# Altium project ATLAS_XP2V5.2016.11.14.PrjPcb (part 2 of 2)

## Sheet ISA_XILINX.SchDoc: ATLAS_XP2V5
size 558 x 431 mm; Organization: IMP Automatika d.o.o.; Revision: V5
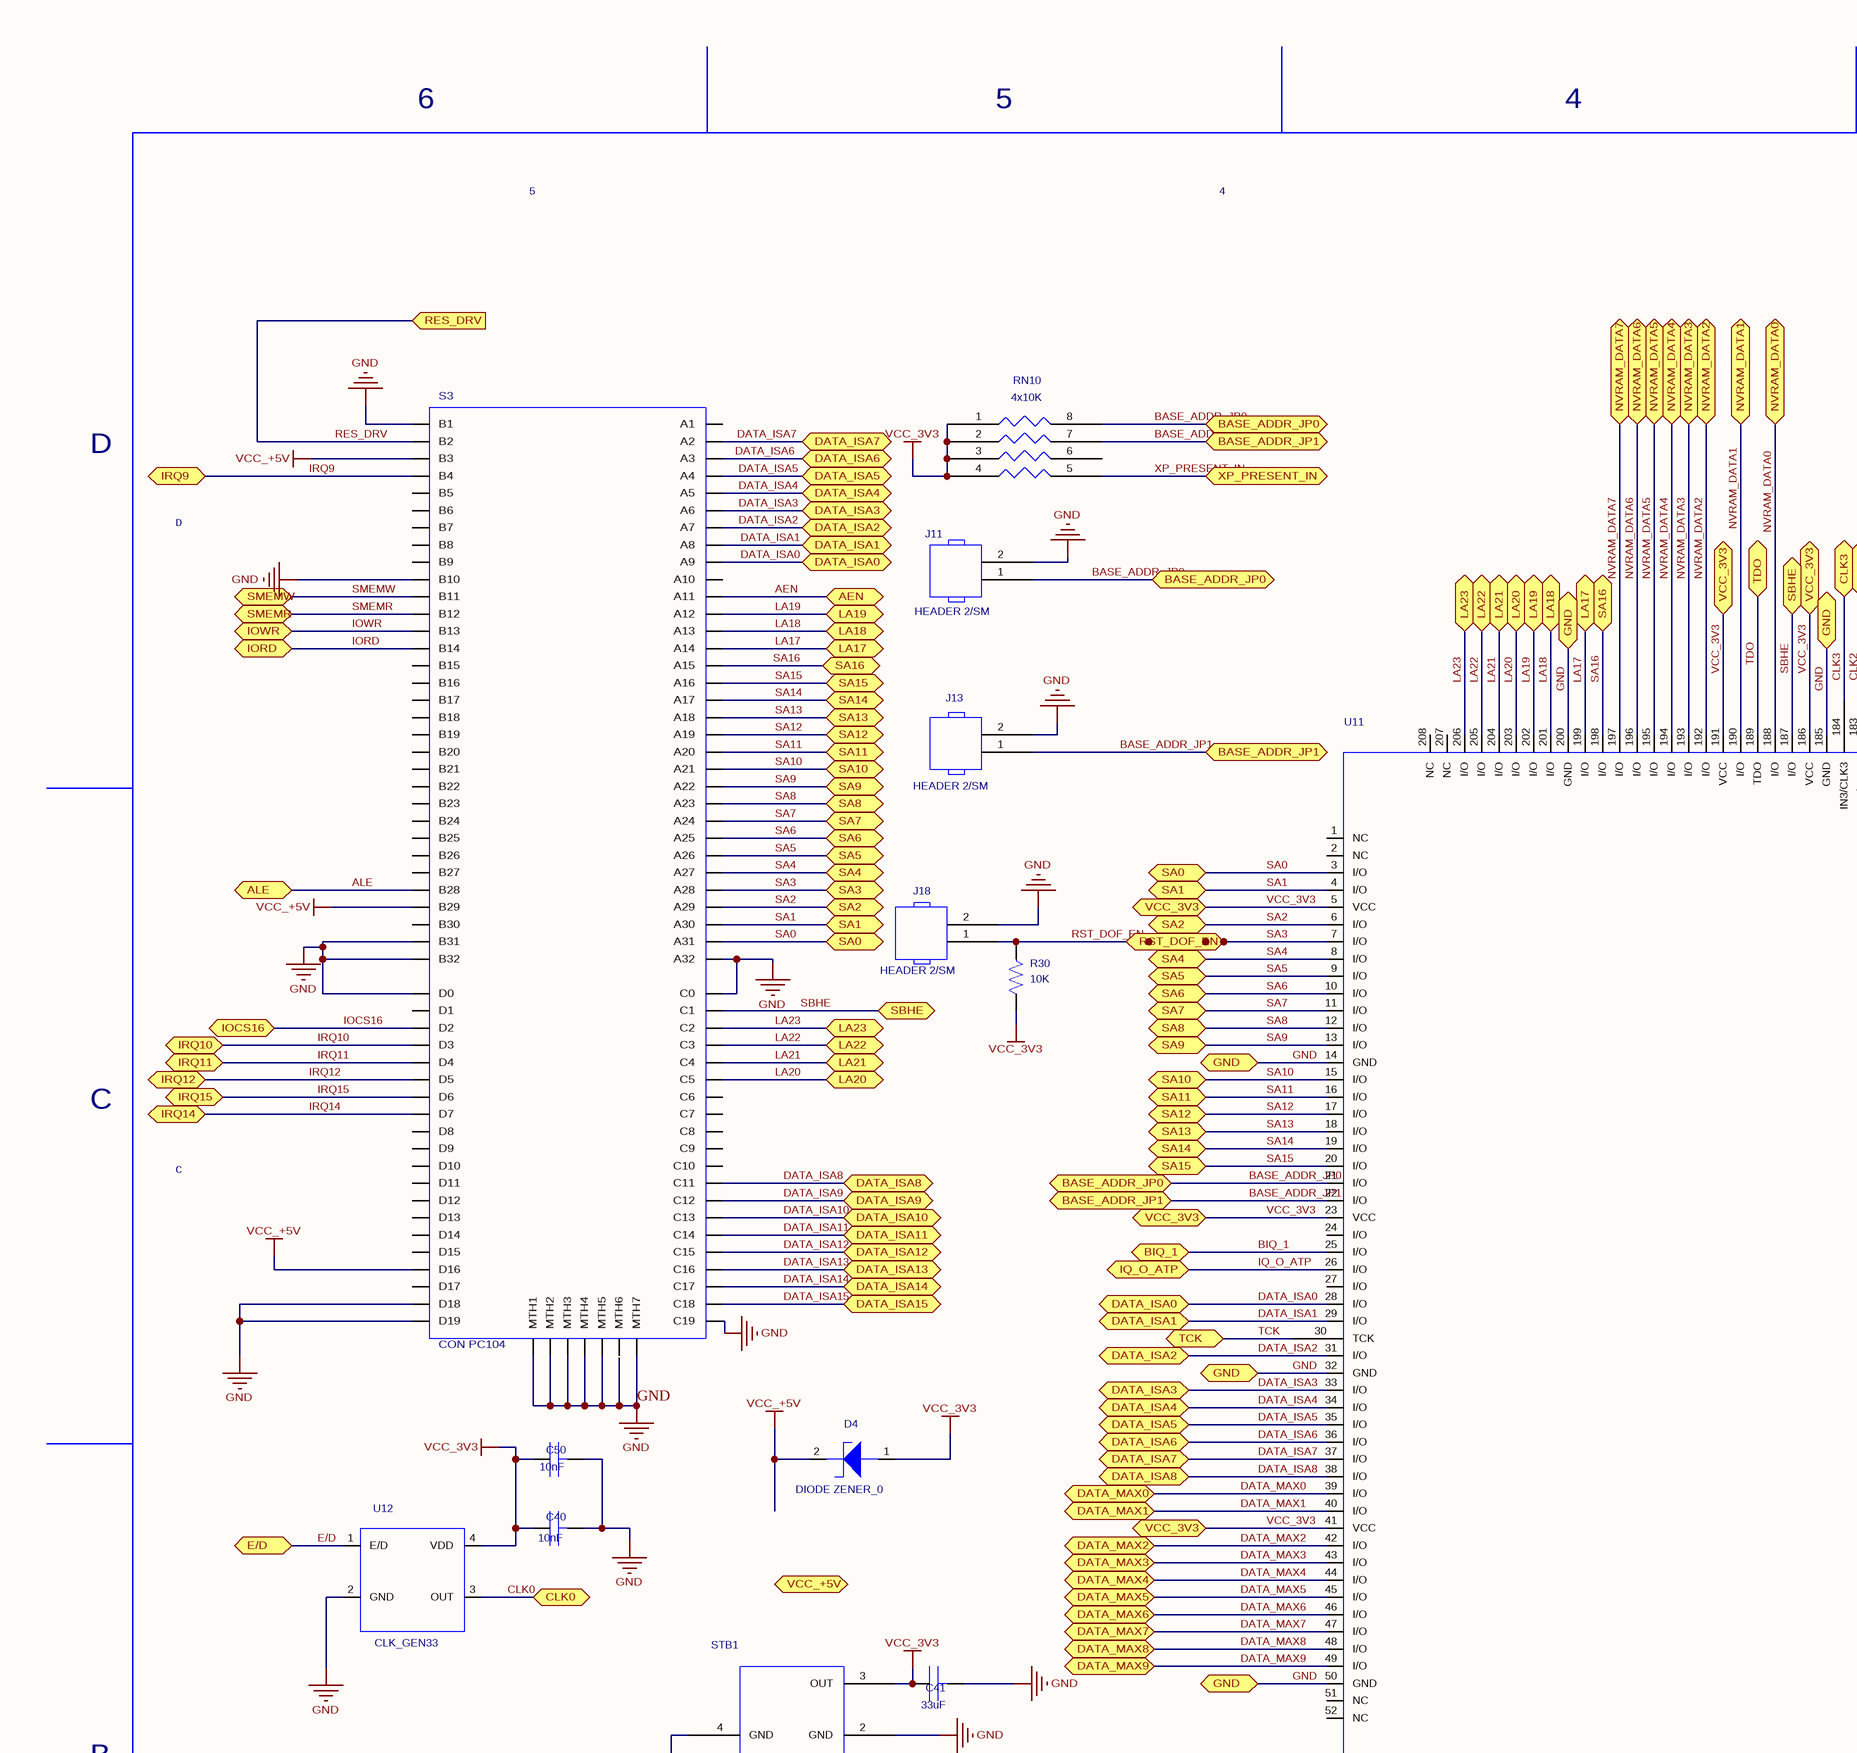
[diagram p20: ISA_XILINX.SchDoc, top left]
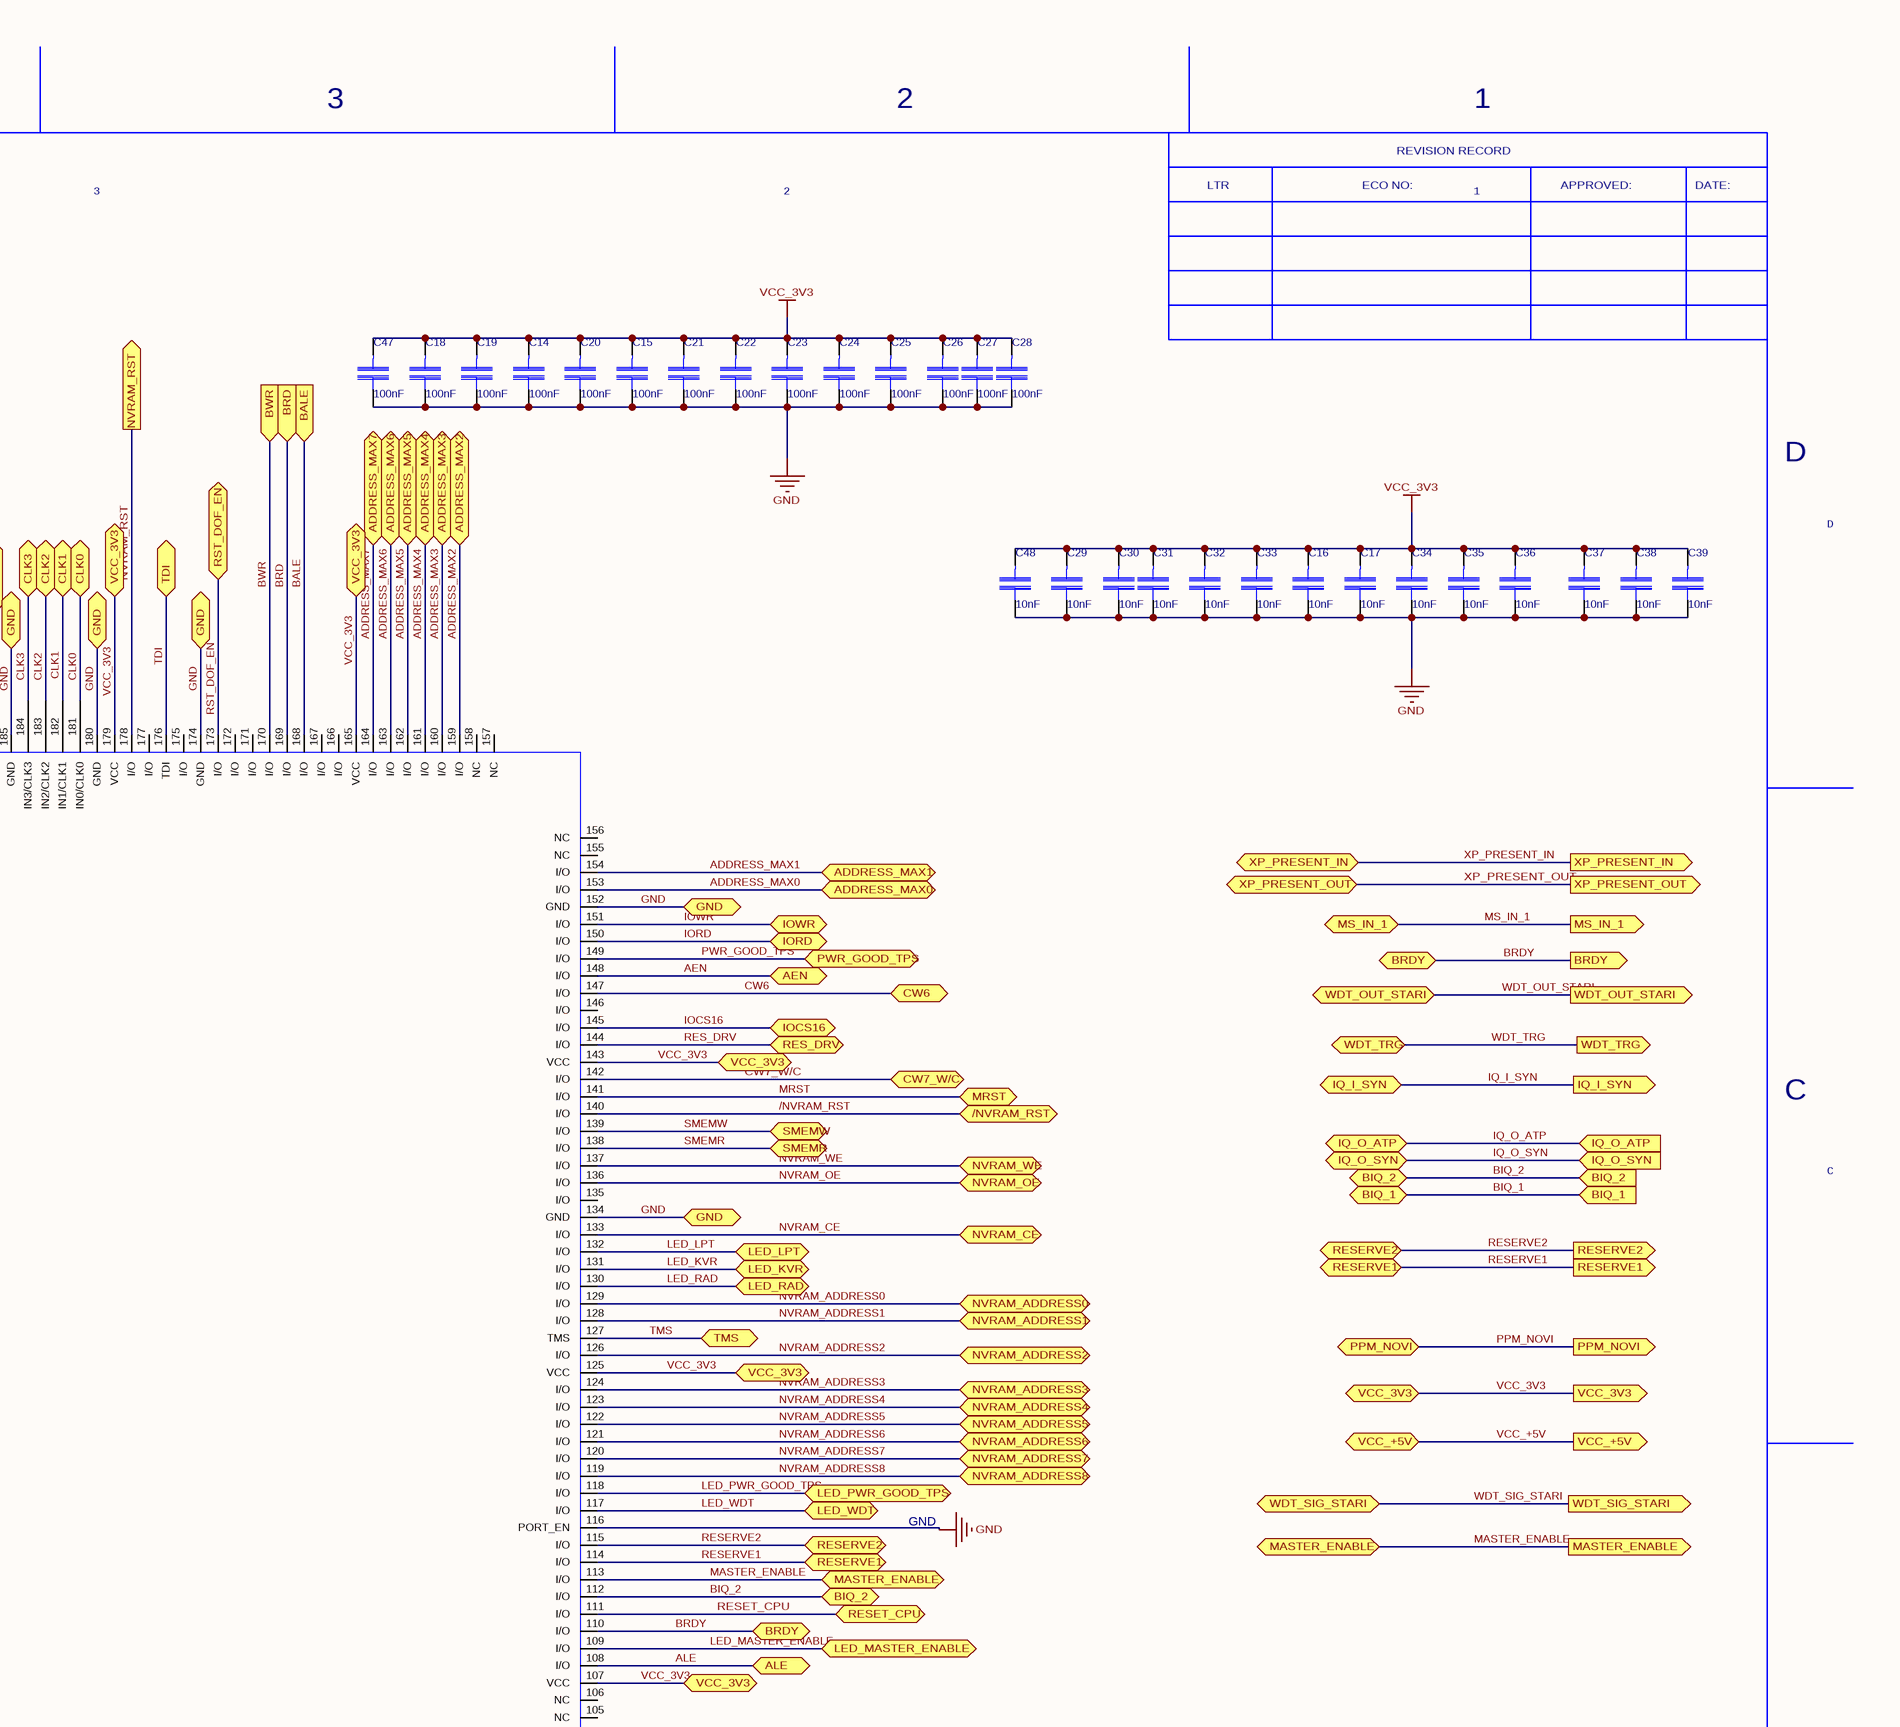
[diagram p21: ISA_XILINX.SchDoc, top right]
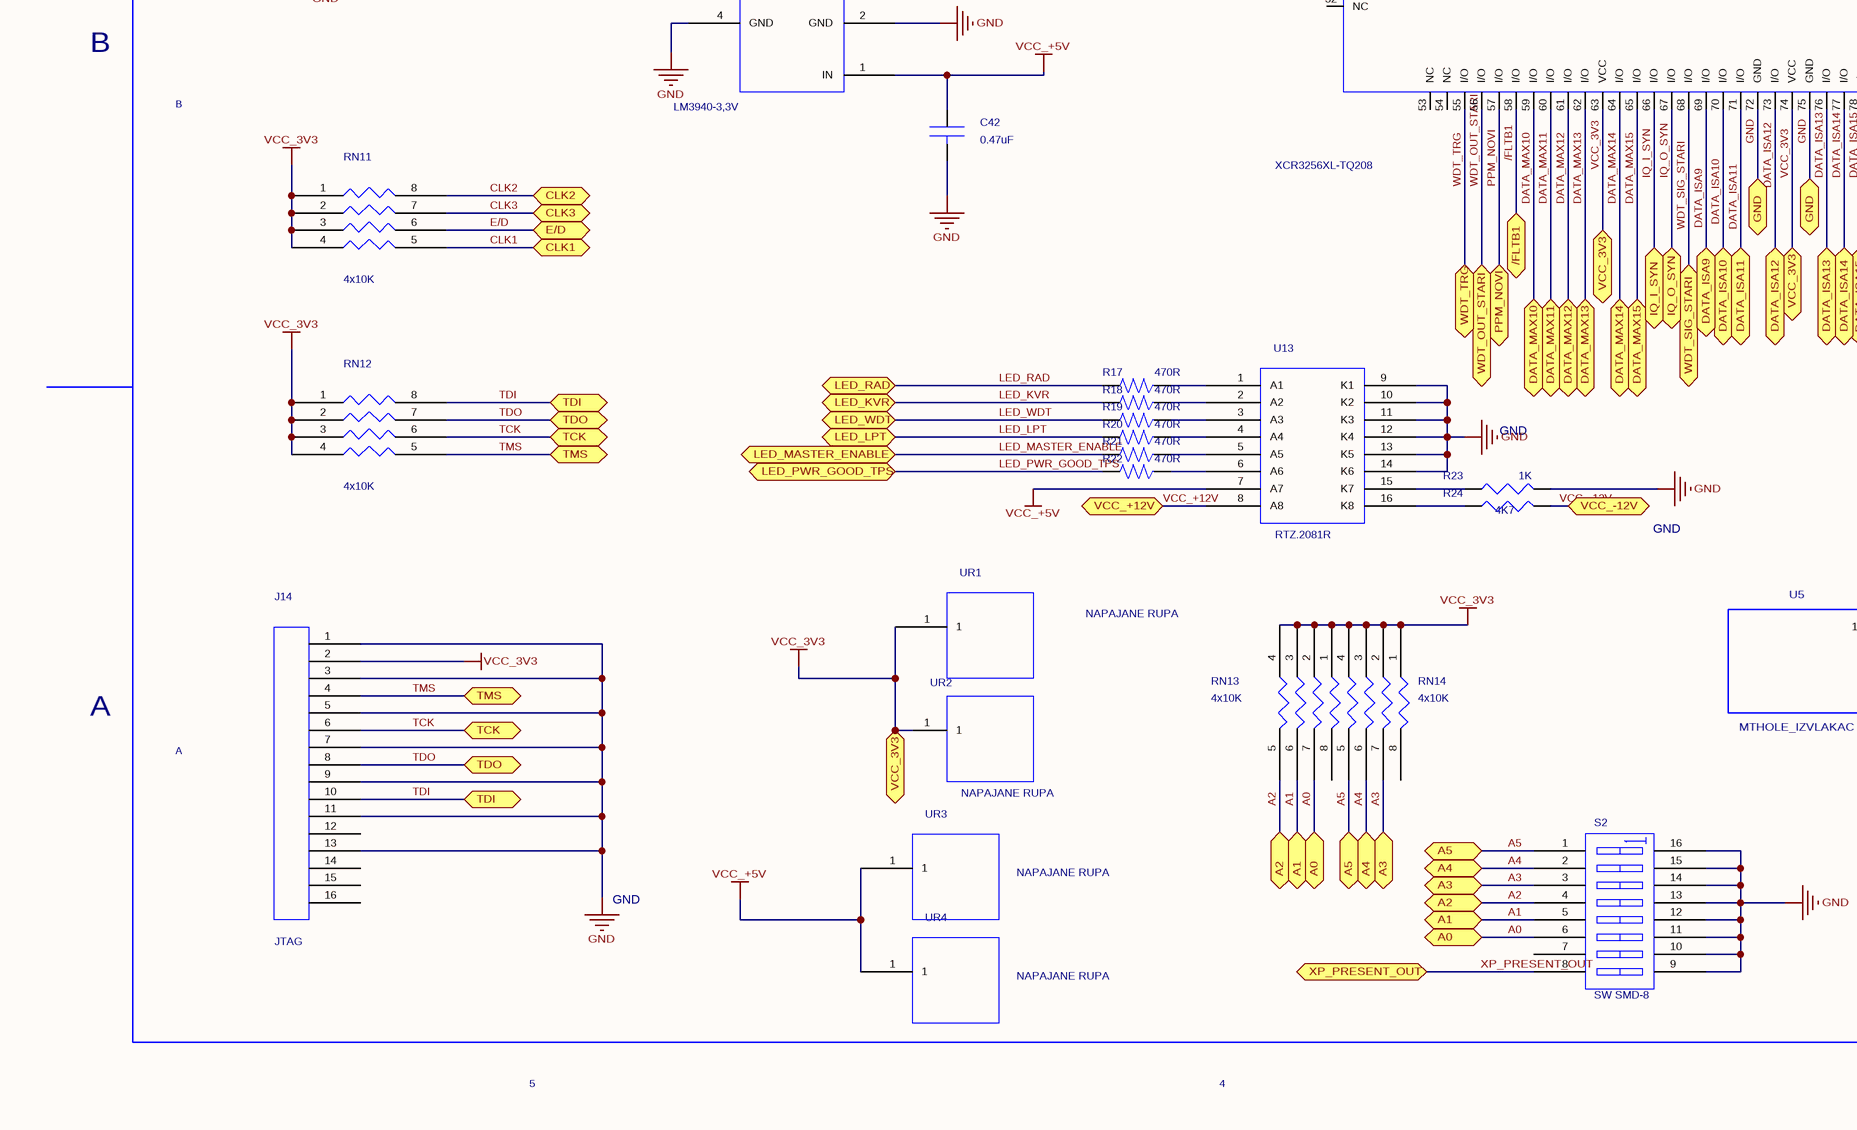
[diagram p22: ISA_XILINX.SchDoc, bottom left]
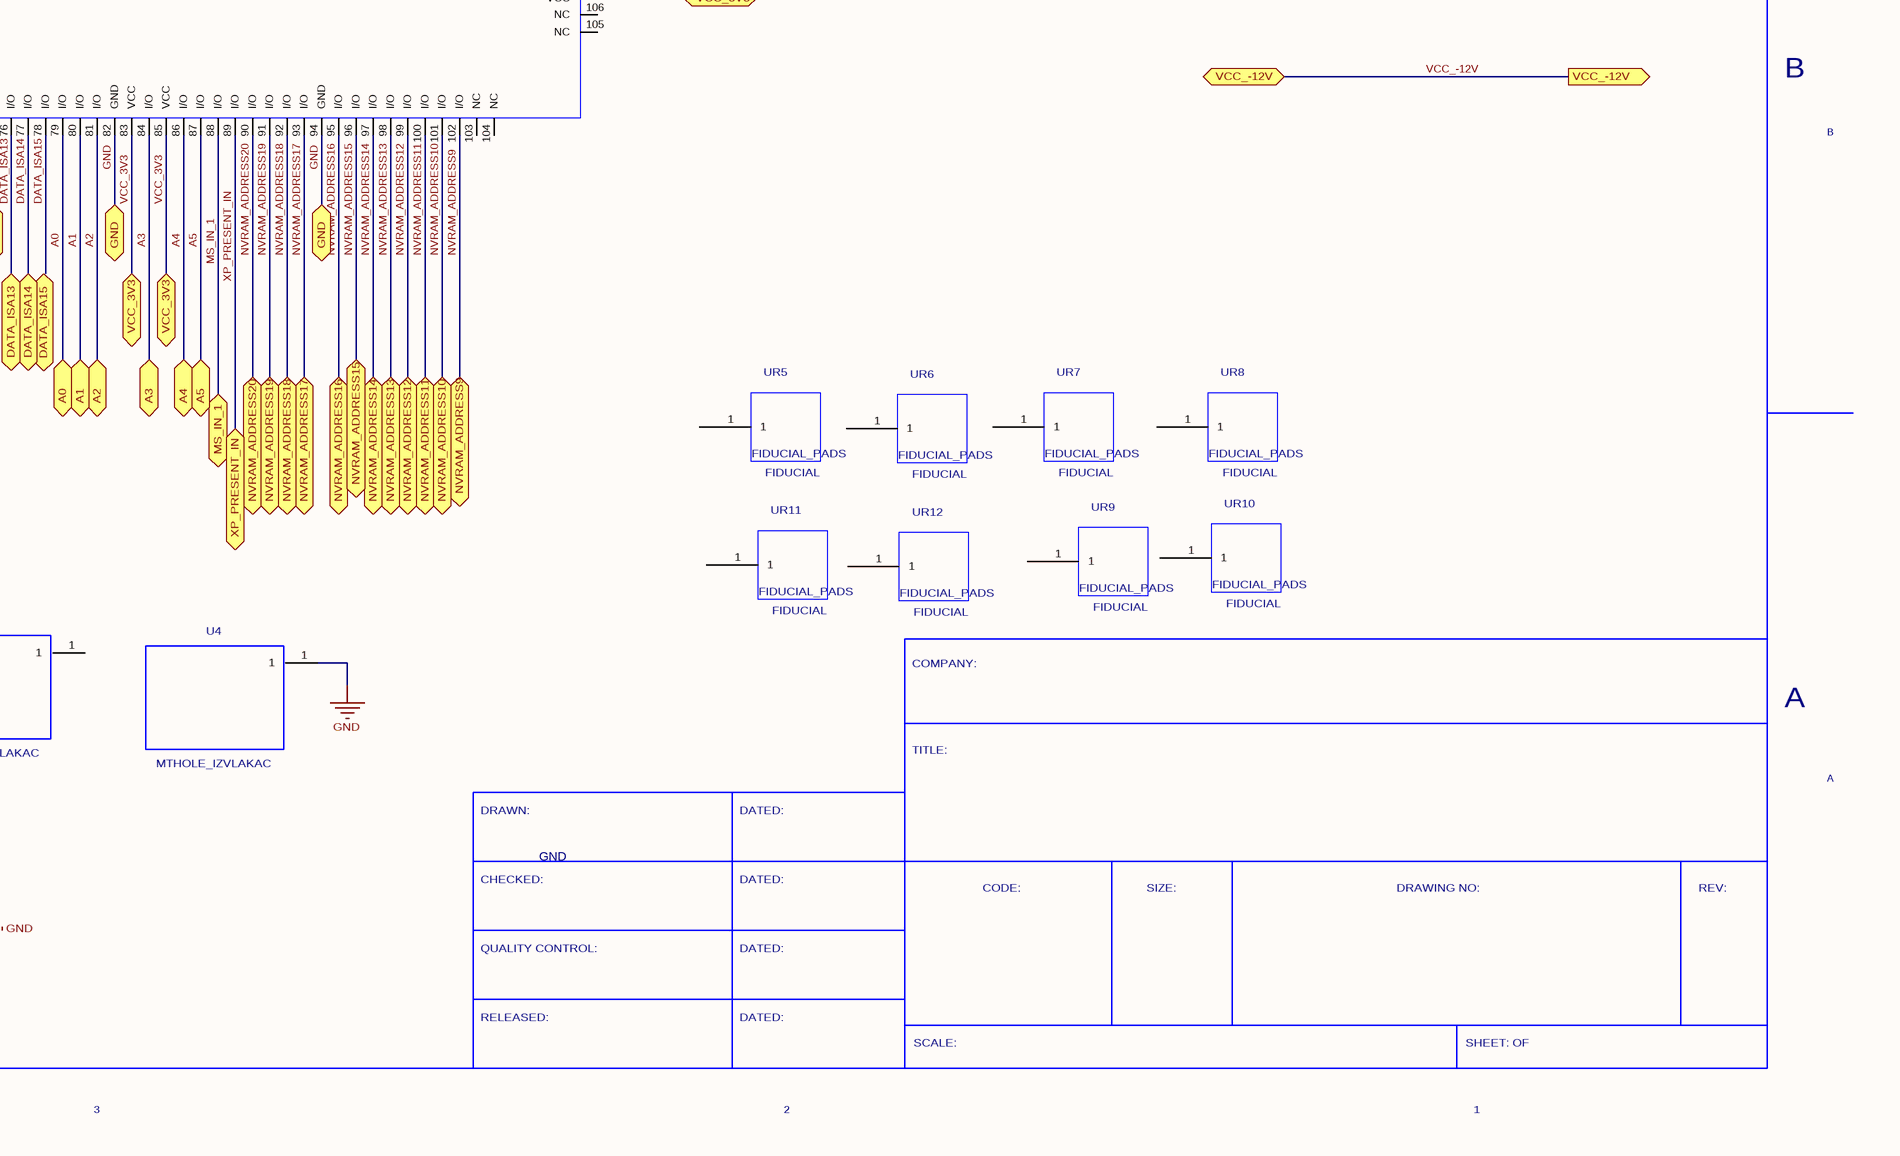
[diagram p23: ISA_XILINX.SchDoc, bottom right]

### Parts
C14  value 100nF  [SM/C_0805]  (hidden comment: C)
C15  value 100nF  [SM/C_0805]  (hidden comment: C)
C16  value 10nF  [SM/C_0805]  (hidden comment: C)
C17  value 10nF  [SM/C_0805]  (hidden comment: C)
C18  value 100nF  [SM/C_0805]  (hidden comment: C)
C19  value 100nF  [SM/C_0805]  (hidden comment: C)
C20  value 100nF  [SM/C_0805]  (hidden comment: C)
C21  value 100nF  [SM/C_0805]  (hidden comment: C)
C22  value 100nF  [SM/C_0805]  (hidden comment: C)
C23  value 100nF  [SM/C_0805]  (hidden comment: C)
C24  value 100nF  [SM/C_0805]  (hidden comment: C)
C25  value 100nF  [SM/C_0805]  (hidden comment: C)
C26  value 100nF  [SM/C_0805]  (hidden comment: C)
C27  value 100nF  [SM/C_0805]  (hidden comment: C)
C28  value 100nF  [SM/C_0805]  (hidden comment: C)
C29  value 10nF  [SM/C_0805]  (hidden comment: C)
C30  value 10nF  [SM/C_0805]  (hidden comment: C)
C31  value 10nF  [SM/C_0805]  (hidden comment: C)
C32  value 10nF  [SM/C_0805]  (hidden comment: C)
C33  value 10nF  [SM/C_0805]  (hidden comment: C)
C34  value 10nF  [SM/C_0805]  (hidden comment: C)
C35  value 10nF  [SM/C_0805]  (hidden comment: C)
C36  value 10nF  [SM/C_0805]  (hidden comment: C)
C37  value 10nF  [SM/C_0805]  (hidden comment: C)
C38  value 10nF  [SM/C_0805]  (hidden comment: C)
C39  value 10nF  [SM/C_0805]  (hidden comment: C)
C40  value 10nF  [SM/C_0805]  (hidden comment: C_4)
C41  value 33uF  [CASE_D_MILOS]  (hidden comment: C_4)
C42  value 0.47uF  [CASE_B_MILOS]  (hidden comment: C_4)
C47  value 100nF  [SM/C_0805]  (hidden comment: C)
C48  value 10nF  [SM/C_0805]  (hidden comment: C)
C50  value 10nF  [SM/C_0805]  (hidden comment: C_4)
D4  value DIODE ZENER_0  [BZV55-C3V3]  (hidden comment: DIODE_ZENER_1)
J11  value HEADER 2/SM  [JUMPER_100]  (hidden comment: HEADER_2/SM)
J13  value HEADER 2/SM  [JUMPER_100]  (hidden comment: HEADER_2/SM)
J14  value JTAG  [JTAG_SMD_REV2]  (hidden comment: CONN_FLEX_16/SM)
J18  value HEADER 2/SM  [JUMPER_100]  (hidden comment: HEADER_2/SM)
R17  value 470R  [SM/R_1206]  (hidden comment: R)
R18  value 470R  [SM/R_1206]  (hidden comment: R)
R19  value 470R  [SM/R_1206]  (hidden comment: R)
R20  value 470R  [SM/R_1206]  (hidden comment: R)
R21  value 470R  [SM/R_1206]  (hidden comment: R)
R22  value 470R  [SM/R_1206]  (hidden comment: R)
R23  value 1K  [SM/R_1206]  (hidden comment: RESISTOR_2)
R24  value 4K7  [SM/R_1206]  (hidden comment: RESISTOR_2)
R30  value 10K  [SM/R_1206]  (hidden comment: R)
RN10  value 4x10K  [SMD_RX4]  (hidden comment: RESAR_IS_4/SM)
RN11  value 4x10K  [SMD_RX4]  (hidden comment: RESAR_IS_4/SM)
RN12  value 4x10K  [SMD_RX4]  (hidden comment: RESAR_IS_4/SM)
RN13  value 4x10K  [SMD_RX4]  (hidden comment: RESAR_IS_4/SM)
RN14  value 4x10K  [SMD_RX4]  (hidden comment: RESAR_IS_4/SM)
S2  value SW SMD-8  [SMD_DIPSW_100]  (hidden comment: SW_DIP-8)
S3  value CON PC104  [WAFER_PADS_REV2]  (hidden comment: CON_EISAE_0)
STB1  value LM3940-3,3V  [TO263AA_GND_PLANE_REV1]  (hidden comment: LM3940-3_3V)
U4  MTHOLE_IZVLAKAC  [MTH_IZVLAKAC_PADS]
U5  MTHOLE_IZVLAKAC  [MTH_IZVLAKAC_PADS]
U11  XCR3256XL-TQ208  [QUAD.50M/208/WG30.60]
U12  CLK_GEN33  [CLK_GEN33_REV1]
U13  value RTZ.2081R  [LED_8_REV3_PADS]  (hidden comment: LED8X1)
UR1  value NAPAJANE RUPA  [NAPAJANJE_RUPA_REV1]  (hidden comment: NAPAJANE_RUPA)
UR2  value NAPAJANE RUPA  [NAPAJANJE_RUPA_REV1]  (hidden comment: NAPAJANE_RUPA)
UR3  value NAPAJANE RUPA  [NAPAJANJE_RUPA_REV1]  (hidden comment: NAPAJANE_RUPA)
UR4  value NAPAJANE RUPA  [NAPAJANJE_RUPA_REV1]  (hidden comment: NAPAJANE_RUPA)
UR5  FIDUCIAL_PADS  value FIDUCIAL  [FIDUCIAL_R_TOP]
UR6  FIDUCIAL_PADS  value FIDUCIAL  [FIDUCIAL_R_TOP]
UR7  FIDUCIAL_PADS  value FIDUCIAL  [FIDUCIAL_R_TOP]
UR8  FIDUCIAL_PADS  value FIDUCIAL  [FIDUCIAL_R_TOP]
UR9  FIDUCIAL_PADS  value FIDUCIAL  [FIDUCIAL_R_TOP]
UR10  FIDUCIAL_PADS  value FIDUCIAL  [FIDUCIAL_R_TOP]
UR11  FIDUCIAL_PADS  value FIDUCIAL  [FIDUCIAL_R_TOP]
UR12  FIDUCIAL_PADS  value FIDUCIAL  [FIDUCIAL_R_TOP]

### Ports
/FLTB1 (bidir), /NVRAM_RST (bidir), A0 (bidir), A1 (bidir), A2 (bidir), A3 (bidir), A4 (bidir), A5 (bidir), ADDRESS_MAX0 (bidir), ADDRESS_MAX1 (bidir), ADDRESS_MAX2 (bidir), ADDRESS_MAX3 (bidir), ADDRESS_MAX4 (bidir), ADDRESS_MAX5 (bidir), ADDRESS_MAX6 (bidir), ADDRESS_MAX7 (bidir), AEN (bidir), ALE (bidir), BALE (in), BASE_ADDR_JP0 (bidir), BASE_ADDR_JP1 (bidir), BIQ_1 (bidir), BIQ_1 (in), BIQ_2 (bidir), BIQ_2 (in), BRD (in), BRDY, BRDY (bidir), BWR (in), CLK0 (bidir), CLK1 (bidir), CLK2 (bidir), CLK3 (bidir), CW6 (bidir), CW7_W/C (bidir), DATA_ISA0 (bidir), DATA_ISA1 (bidir), DATA_ISA2 (bidir), DATA_ISA3 (bidir), DATA_ISA4 (bidir), DATA_ISA5 (bidir), DATA_ISA6 (bidir), DATA_ISA7 (bidir), DATA_ISA8 (bidir), DATA_ISA9 (bidir), DATA_ISA10 (bidir), DATA_ISA11 (bidir), DATA_ISA12 (bidir), DATA_ISA13 (bidir), DATA_ISA14 (bidir), DATA_ISA15 (bidir), DATA_MAX0 (bidir), DATA_MAX1 (bidir), DATA_MAX2 (bidir), DATA_MAX3 (bidir), DATA_MAX4 (bidir), DATA_MAX5 (bidir), DATA_MAX6 (bidir), DATA_MAX7 (bidir), DATA_MAX8 (bidir), DATA_MAX9 (bidir), DATA_MAX10 (bidir), DATA_MAX11 (bidir), DATA_MAX12 (bidir), DATA_MAX13 (bidir), DATA_MAX14 (bidir), DATA_MAX15 (bidir), E/D (bidir), GND (bidir), IOCS16 (bidir), IORD (bidir), IOWR (bidir), IQ_I_SYN, IQ_I_SYN (bidir), IQ_O_ATP (bidir), IQ_O_ATP (in), IQ_O_SYN (bidir), IQ_O_SYN (in), IRQ9 (bidir), IRQ10 (bidir), IRQ11 (bidir), IRQ12 (bidir), IRQ14 (bidir), IRQ15 (bidir), LA17 (bidir), LA18 (bidir), LA19 (bidir), LA20 (bidir), LA21 (bidir), LA22 (bidir), LA23 (bidir), LED_KVR (bidir), LED_LPT (bidir), LED_MASTER_ENABLE (bidir), LED_PWR_GOOD_TPS (bidir), LED_RAD (bidir), LED_WDT (bidir), MASTER_ENABLE, MASTER_ENABLE (bidir), MRST (bidir), MS_IN_1, MS_IN_1 (bidir), NVRAM_ADDRESS0 (bidir), NVRAM_ADDRESS1 (bidir), NVRAM_ADDRESS2 (bidir), NVRAM_ADDRESS3 (bidir), NVRAM_ADDRESS4 (bidir), NVRAM_ADDRESS5 (bidir), NVRAM_ADDRESS6 (bidir), NVRAM_ADDRESS7 (bidir), NVRAM_ADDRESS8 (bidir), NVRAM_ADDRESS9 (bidir), NVRAM_ADDRESS10 (bidir), NVRAM_ADDRESS11 (bidir), NVRAM_ADDRESS12 (bidir), NVRAM_ADDRESS13 (bidir), NVRAM_ADDRESS14 (bidir), NVRAM_ADDRESS15 (bidir), NVRAM_ADDRESS16 (bidir), NVRAM_ADDRESS17 (bidir), NVRAM_ADDRESS18 (bidir), NVRAM_ADDRESS19 (bidir), NVRAM_ADDRESS20 (bidir), NVRAM_CE (bidir), NVRAM_DATA0 (bidir), NVRAM_DATA1 (bidir), NVRAM_DATA2 (bidir), NVRAM_DATA3 (bidir), NVRAM_DATA4 (bidir), NVRAM_DATA5 (bidir), NVRAM_DATA6 (bidir), NVRAM_DATA7 (bidir), NVRAM_OE (bidir), NVRAM_RST, NVRAM_WE (bidir), PPM_NOVI, PPM_NOVI (bidir), PWR_GOOD_TPS (bidir), RES_DRV (bidir), RES_DRV (in), RESERVE1, RESERVE1 (bidir), RESERVE2, RESERVE2 (bidir), RESET_CPU (bidir), RST_DOF_EN (bidir), SA0 (bidir), SA1 (bidir), SA2 (bidir), SA3 (bidir), SA4 (bidir), SA5 (bidir), SA6 (bidir), SA7 (bidir), SA8 (bidir), SA9 (bidir), SA10 (bidir), SA11 (bidir), SA12 (bidir), SA13 (bidir), SA14 (bidir), SA15 (bidir), SA16 (bidir), SBHE (bidir), SMEMR (bidir), SMEMW (bidir), TCK (bidir), TDI (bidir), TDO (bidir), TMS (bidir), VCC_3V3, VCC_3V3 (bidir), VCC_+5V, VCC_+5V (bidir), VCC_+12V (bidir), VCC_-12V, VCC_-12V (bidir), WDT_OUT_STARI, WDT_OUT_STARI (bidir), WDT_SIG_STARI, WDT_SIG_STARI (bidir), WDT_TRG (bidir), WDT_TRG (out), XP_PRESENT_IN, XP_PRESENT_IN (bidir), XP_PRESENT_OUT, XP_PRESENT_OUT (bidir)

### Nets
GND: C14.2 C15.2 C16.2 C17.2 C18.2 C19.2 C20.2 C21.2 C22.2 C23.2 C24.2 C25.2 C26.2 C27.2 C28.2 C29.2 C30.2 C31.2 C32.2 C33.2 C34.2 C35.2 C36.2 C37.2 C38.2 C39.2 C40.2 C41.2 C42.2 C47.2 C48.2 C50.2 J11.2 J13.2 J14.1 J14.3 J14.5 J14.7 J14.9 J14.11 J14.13 J18.2 R23.2 S2.9(B8) S2.10(B7) S2.11(B6) S2.12(B5) S2.13(B4) S2.14(B3) S2.15(B2) S2.16(B1) S3.A32 S3.B1 S3.B10 S3.B31 S3.B32 S3.C0 S3.C19 S3.D0 S3.D18 S3.D19 S3.MTH1 S3.MTH2 S3.MTH3 S3.MTH4 S3.MTH5 S3.MTH7 STB1.2(GND) STB1.4(GND) U4.1 U11.14(GND) U11.32(GND) U11.50(GND) U11.72(GND) U11.75(GND) U11.82(GND) U11.94(GND) U11.116(PORT_EN) U11.134(GND) U11.152(GND) U11.174(GND) U11.180(GND) U11.185(GND) U11.200(GND) U12.2(GND) U13.9(K1) U13.10(K2) U13.11(K3) U13.12(K4) U13.13(K5) U13.14(K6) ; port GND
VCC_3V3: C14.1 C15.1 C16.1 C17.1 C18.1 C19.1 C20.1 C21.1 C22.1 C23.1 C24.1 C25.1 C26.1 C27.1 C28.1 C29.1 C30.1 C31.1 C32.1 C33.1 C34.1 C35.1 C36.1 C37.1 C38.1 C39.1 C40.1 C41.1 C47.1 C48.1 C50.1 D4.1(ANODE) J14.2 R30.2 RN10.1 RN10.2 RN10.3 RN10.4 RN11.1 RN11.2 RN11.3 RN11.4 RN12.1 RN12.2 RN12.3 RN12.4 RN13.1 RN13.2 RN13.3 RN13.4 RN14.1 RN14.2 RN14.3 RN14.4 STB1.3(OUT) U11.5(VCC) U11.23(VCC) U11.41(VCC) U11.63(VCC) U11.74(VCC) U11.83(VCC) U11.85(VCC) U11.107(VCC) U11.125(VCC) U11.143(VCC) U11.165(VCC) U11.179(VCC) U11.186(VCC) U11.191(VCC) U12.4(VDD) UR1.1 UR2.1 ; port VCC_3V3
VCC_+5V: C42.1 D4.2(CATHODE) S3.B3 S3.B29 S3.D16 STB1.1(IN) U13.7(A7) UR3.1 UR4.1 ; port VCC_+5V  [project net DATA_MAX_BUS12]
VCC_+12V: U13.8(A8) ; port VCC_+12V
VCC_-12V: R24.2 ; port VCC_-12V
/FLTB1: U11.58(I/O) ; port /FLTB1
/NVRAM_RST: U11.140(I/O) ; port /NVRAM_RST
A0: RN13.7 S2.6(A6) U11.79(I/O) ; port A0
A1: RN13.6 S2.5(A5) U11.80(I/O) ; port A1
A2: RN13.5 S2.4(A4) U11.81(I/O) ; port A2
A3: RN14.7 S2.3(A3) U11.84(I/O) ; port A3
A4: RN14.6 S2.2(A2) U11.86(I/O) ; port A4
A5: RN14.5 S2.1(A1) U11.87(I/O) ; port A5
ADDRESS_MAX0: U11.153(I/O) ; port ADDRESS_MAX0
ADDRESS_MAX1: U11.154(I/O) ; port ADDRESS_MAX1
ADDRESS_MAX2: U11.159(I/O) ; port ADDRESS_MAX2
ADDRESS_MAX3: U11.160(I/O) ; port ADDRESS_MAX3
ADDRESS_MAX4: U11.161(I/O) ; port ADDRESS_MAX4
ADDRESS_MAX5: U11.162(I/O) ; port ADDRESS_MAX5
ADDRESS_MAX6: U11.163(I/O) ; port ADDRESS_MAX6
ADDRESS_MAX7: U11.164(I/O) ; port ADDRESS_MAX7
AEN: S3.A11 U11.148(I/O) ; port AEN
ALE: S3.B28 U11.108(I/O) ; port ALE
BALE: U11.168(I/O) ; port BALE
BASE_ADDR_JP0: J11.1 RN10.8 U11.21(I/O) ; port BASE_ADDR_JP0
BASE_ADDR_JP1: J13.1 RN10.7 U11.22(I/O) ; port BASE_ADDR_JP1
BIQ_1: U11.25(I/O) ; port BIQ_1
BIQ_2: U11.112(I/O) ; port BIQ_2
BRD: U11.169(I/O) ; port BRD
BRDY: U11.110(I/O) ; port BRDY
BWR: U11.170(I/O) ; port BWR
CLK0: U11.181(IN0/CLK0) U12.3(OUT) ; port CLK0
CLK1: RN11.5 U11.182(IN1/CLK1) ; port CLK1
CLK2: RN11.8 U11.183(IN2/CLK2) ; port CLK2
CLK3: RN11.7 U11.184(IN3/CLK3) ; port CLK3
CW6: U11.147(I/O) ; port CW6
CW7_W/C: U11.142(I/O) ; port CW7_W/C
DATA_ISA0: S3.A9 U11.28(I/O) ; port DATA_ISA0
DATA_ISA1: S3.A8 U11.29(I/O) ; port DATA_ISA1
DATA_ISA2: S3.A7 U11.31(I/O) ; port DATA_ISA2
DATA_ISA3: S3.A6 U11.33(I/O) ; port DATA_ISA3
DATA_ISA4: S3.A5 U11.34(I/O) ; port DATA_ISA4
DATA_ISA5: S3.A4 U11.35(I/O) ; port DATA_ISA5
DATA_ISA6: S3.A3 U11.36(I/O) ; port DATA_ISA6
DATA_ISA7: S3.A2 U11.37(I/O) ; port DATA_ISA7
DATA_ISA8: S3.C11 U11.38(I/O) ; port DATA_ISA8
DATA_ISA9: S3.C12 U11.69(I/O) ; port DATA_ISA9
DATA_ISA10: S3.C13 U11.70(I/O) ; port DATA_ISA10
DATA_ISA11: S3.C14 U11.71(I/O) ; port DATA_ISA11
DATA_ISA12: S3.C15 U11.73(I/O) ; port DATA_ISA12
DATA_ISA13: S3.C16 U11.76(I/O) ; port DATA_ISA13
DATA_ISA14: S3.C17 U11.77(I/O) ; port DATA_ISA14
DATA_ISA15: S3.C18 U11.78(I/O) ; port DATA_ISA15
DATA_MAX0: U11.39(I/O) ; port DATA_MAX0
DATA_MAX1: U11.40(I/O) ; port DATA_MAX1
DATA_MAX2: U11.42(I/O) ; port DATA_MAX2
DATA_MAX3: U11.43(I/O) ; port DATA_MAX3
DATA_MAX4: U11.44(I/O) ; port DATA_MAX4
DATA_MAX5: U11.45(I/O) ; port DATA_MAX5
DATA_MAX6: U11.46(I/O) ; port DATA_MAX6
DATA_MAX7: U11.47(I/O) ; port DATA_MAX7
DATA_MAX8: U11.48(I/O) ; port DATA_MAX8
DATA_MAX9: U11.49(I/O) ; port DATA_MAX9
DATA_MAX10: U11.59(I/O) ; port DATA_MAX10
DATA_MAX11: U11.60(I/O) ; port DATA_MAX11
DATA_MAX12: U11.61(I/O) ; port DATA_MAX12
DATA_MAX13: U11.62(I/O) ; port DATA_MAX13
DATA_MAX14: U11.64(I/O) ; port DATA_MAX14
DATA_MAX15: U11.65(I/O) ; port DATA_MAX15
E/D: RN11.6 U12.1(E/D) ; port E/D
IOCS16: S3.D2 U11.145(I/O) ; port IOCS16
IORD: S3.B14 U11.150(I/O) ; port IORD
IOWR: S3.B13 U11.151(I/O) ; port IOWR
IQ_I_SYN: U11.66(I/O) ; port IQ_I_SYN
IQ_O_ATP: U11.26(I/O) ; port IQ_O_ATP
IQ_O_SYN: U11.67(I/O) ; port IQ_O_SYN
IRQ9: S3.B4 ; port IRQ9
IRQ10: S3.D3 ; port IRQ10
IRQ11: S3.D4 ; port IRQ11
IRQ12: S3.D5 ; port IRQ12
IRQ14: S3.D7 ; port IRQ14
IRQ15: S3.D6 ; port IRQ15
LA17: S3.A14 U11.199(I/O) ; port LA17
LA18: S3.A13 U11.201(I/O) ; port LA18
LA19: S3.A12 U11.202(I/O) ; port LA19
LA20: S3.C5 U11.203(I/O) ; port LA20
LA21: S3.C4 U11.204(I/O) ; port LA21
LA22: S3.C3 U11.205(I/O) ; port LA22
LA23: S3.C2 U11.206(I/O) ; port LA23
LED_KVR: R18.2 U11.131(I/O) ; port LED_KVR
LED_LPT: R20.2 U11.132(I/O) ; port LED_LPT
LED_MASTER_ENABLE: R21.2 U11.109(I/O) ; port LED_MASTER_ENABLE
LED_PWR_GOOD_TPS: R22.2 U11.118(I/O) ; port LED_PWR_GOOD_TPS
LED_RAD: R17.2 U11.130(I/O) ; port LED_RAD
LED_WDT: R19.2 U11.117(I/O) ; port LED_WDT
MASTER_ENABLE: U11.113(I/O) ; port MASTER_ENABLE
MRST: U11.141(I/O) ; port MRST
MS_IN_1: U11.88(I/O) ; port MS_IN_1
NVRAM_ADDRESS0: U11.129(I/O) ; port NVRAM_ADDRESS0
NVRAM_ADDRESS1: U11.128(I/O) ; port NVRAM_ADDRESS1
NVRAM_ADDRESS2: U11.126(I/O) ; port NVRAM_ADDRESS2
NVRAM_ADDRESS3: U11.124(I/O) ; port NVRAM_ADDRESS3
NVRAM_ADDRESS4: U11.123(I/O) ; port NVRAM_ADDRESS4
NVRAM_ADDRESS5: U11.122(I/O) ; port NVRAM_ADDRESS5
NVRAM_ADDRESS6: U11.121(I/O) ; port NVRAM_ADDRESS6
NVRAM_ADDRESS7: U11.120(I/O) ; port NVRAM_ADDRESS7
NVRAM_ADDRESS8: U11.119(I/O) ; port NVRAM_ADDRESS8
NVRAM_ADDRESS9: U11.102(I/O) ; port NVRAM_ADDRESS9
NVRAM_ADDRESS10: U11.101(I/O) ; port NVRAM_ADDRESS10
NVRAM_ADDRESS11: U11.100(I/O) ; port NVRAM_ADDRESS11
NVRAM_ADDRESS12: U11.99(I/O) ; port NVRAM_ADDRESS12
NVRAM_ADDRESS13: U11.98(I/O) ; port NVRAM_ADDRESS13
NVRAM_ADDRESS14: U11.97(I/O) ; port NVRAM_ADDRESS14
NVRAM_ADDRESS15: U11.96(I/O) ; port NVRAM_ADDRESS15
NVRAM_ADDRESS16: U11.95(I/O) ; port NVRAM_ADDRESS16
NVRAM_ADDRESS17: U11.93(I/O) ; port NVRAM_ADDRESS17
NVRAM_ADDRESS18: U11.92(I/O) ; port NVRAM_ADDRESS18
NVRAM_ADDRESS19: U11.91(I/O) ; port NVRAM_ADDRESS19
NVRAM_ADDRESS20: U11.90(I/O) ; port NVRAM_ADDRESS20
NVRAM_CE: U11.133(I/O) ; port NVRAM_CE
NVRAM_DATA0: U11.188(I/O) ; port NVRAM_DATA0
NVRAM_DATA1: U11.190(I/O) ; port NVRAM_DATA1
NVRAM_DATA2: U11.192(I/O) ; port NVRAM_DATA2
NVRAM_DATA3: U11.193(I/O) ; port NVRAM_DATA3
NVRAM_DATA4: U11.194(I/O) ; port NVRAM_DATA4
NVRAM_DATA5: U11.195(I/O) ; port NVRAM_DATA5
NVRAM_DATA6: U11.196(I/O) ; port NVRAM_DATA6
NVRAM_DATA7: U11.197(I/O) ; port NVRAM_DATA7
NVRAM_OE: U11.136(I/O) ; port NVRAM_OE
NVRAM_RST: U11.178(I/O) ; port NVRAM_RST
NVRAM_WE: U11.137(I/O) ; port NVRAM_WE
PPM_NOVI: U11.57(I/O) ; port PPM_NOVI
PWR_GOOD_TPS: U11.149(I/O) ; port PWR_GOOD_TPS
RES_DRV: S3.B2 U11.144(I/O) ; port RES_DRV
RESERVE1: U11.114(I/O) ; port RESERVE1
RESERVE2: U11.115(I/O) ; port RESERVE2
RESET_CPU: U11.111(I/O) ; port RESET_CPU
RST_DOF_EN: J18.1 R30.1 S3.A28 U11.7(I/O) U11.173(I/O) ; port SA3, port RST_DOF_EN  [also labelled SA3]
SA0: S3.A31 U11.3(I/O) ; port SA0
SA1: S3.A30 U11.4(I/O) ; port SA1
SA2: S3.A29 U11.6(I/O) ; port SA2
SA4: S3.A27 U11.8(I/O) ; port SA4
SA5: S3.A26 U11.9(I/O) ; port SA5
SA6: S3.A25 U11.10(I/O) ; port SA6
SA7: S3.A24 U11.11(I/O) ; port SA7
SA8: S3.A23 U11.12(I/O) ; port SA8
SA9: S3.A22 U11.13(I/O) ; port SA9
SA10: S3.A21 U11.15(I/O) ; port SA10
SA11: S3.A20 U11.16(I/O) ; port SA11
SA12: S3.A19 U11.17(I/O) ; port SA12
SA13: S3.A18 U11.18(I/O) ; port SA13
SA14: S3.A17 U11.19(I/O) ; port SA14
SA15: S3.A16 U11.20(I/O) ; port SA15
SA16: S3.A15 U11.198(I/O) ; port SA16
SBHE: S3.C1 U11.187(I/O) ; port SBHE
SMEMR: S3.B12 U11.138(I/O) ; port SMEMR
SMEMW: S3.B11 U11.139(I/O) ; port SMEMW
TCK: J14.6 RN12.6 U11.30(TCK) ; port TCK
TDI: J14.10 RN12.8 U11.176(TDI) ; port TDI
TDO: J14.8 RN12.7 U11.189(TDO) ; port TDO
TMS: J14.4 RN12.5 U11.127(TMS) ; port TMS
WDT_OUT_STARI: U11.56(I/O) ; port WDT_OUT_STARI
WDT_SIG_STARI: U11.68(I/O) ; port WDT_SIG_STARI
WDT_TRG: U11.55(I/O) ; port WDT_TRG
XP_PRESENT_IN: RN10.5 U11.89(I/O) ; port XP_PRESENT_IN
XP_PRESENT_OUT: S2.8(A8) ; port XP_PRESENT_OUT
NetR17_1: R17.1 U13.1(A1)
NetR18_1: R18.1 U13.2(A2)
NetR19_1: R19.1 U13.3(A3)
NetR20_1: R20.1 U13.4(A4)
NetR21_1: R21.1 U13.5(A5)
NetR22_1: R22.1 U13.6(A6)
NetR23_1: R23.1 U13.15(K7)
NetR24_1: R24.1 U13.16(K8)

Not connected (* = marked no-connect by the designer): J14 12 14 15 16; RN10 6; RN13 8; RN14 8; S2 7(A7); S3 A1 A10 B5 B6 B7 B8 B9 B15 B16 B17 B18 B19 B20 B21 B22 B23 B24 B25 B26 B27 B30 C6 C7 C8 C9 C10 D1 D8 D9 D10 D11 D12 D13 D14 D15 D17 MTH6; U5 1; U11 1(NC) 2(NC) 24(I/O) 27(I/O) 51(NC) 52(NC) 53(NC) 54(NC) 103(NC) 104(NC) 105(NC) 106(NC) 135(I/O) 146(I/O) 155(NC) 156(NC) 157(NC) 158(NC) 166(I/O) 167(I/O) 171(I/O) 172(I/O) 175(I/O) 177(I/O) 207(NC) 208(NC); UR5 1; UR6 1; UR7 1; UR8 1; UR9 1; UR10 1; UR11 1; UR12 1

### Notes on the sheet
- 6
- 5
- 4
- 3
- 2
- 1
- LTR
- ECO NO:
- REVISION RECORD
- APPROVED:
- DATE:
- D
- C
- GND
- B
- COMPANY:
- A
- TITLE:
- DRAWN:
- DATED:
- CHECKED:
- CODE:
- SIZE:
- DRAWING NO:
- REV:
- QUALITY CONTROL:
- RELEASED:
- SCALE:
- SHEET: OF

### Library data of the parts
C14-C39 C47 C48 = C: Source_Path: D:\ORCADWIN\CAPTURE\ATP_LATT_01\ATP_00.OLB; SDTSourceLibName: C:\WINDOWS\TEMP\ATP_00.LIB; PCB DECAL: SM/C_0805
C40-C42 C50 = C_4: Source_Path: C:\ORCAD\ORCAD_10.5\TOOLS\CAPTURE\LIBRARY\IEC\DEVICE.OLB
  C40 C50: PCB DECAL: SM/C_0805
  C41: PCB DECAL: CASE_D_MILOS
  C42: PCB DECAL: CASE_B_MILOS
D4 = DIODE_ZENER_1: Source_Path: E:\MILOS\PROJECTS\ATLAS_XP2V3\ATLAS_XP2V3.DSN; PCB DECAL: BZV55-C3V3
J11 J13 J18 = HEADER_2/SM: Source_Path: C:\ORCAD\ORCAD_10.5\TOOLS\CAPTURE\LIBRARY\CONNECTOR.OLB; PCB DECAL: JUMPER_100
J14 = CONN_FLEX_16/SM: Source_Path: C:\ORCAD\ORCAD_10.5\TOOLS\CAPTURE\LIBRARY\CONNECTOR.OLB; PCB DECAL: JTAG_SMD_REV2
R17-R22 R30 = R: Source_Path: C:\ORCAD\ORCAD_10.0\TOOLS\CAPTURE\LIBRARY\PSPICE\ANALOG.OLB; DIST: FLAT; PSpiceTemplate: R^@REFDES %1 %2 ?TOLERANCE|R^@REFDES| @VALUE  ?TOLERANCE|\n.model R^@REFDES RES R=1 DEV=@TOLERANCE%|; VOLTAGE: RVMAX; SLOPE: RSMAX; MAX_TEMP: RTMAX; POWER: RMAX; PCB DECAL: SM/R_1206
R23 R24 = RESISTOR_2: Source_Path: C:\CADENCE\PSD_15.1\TOOLS\CAPTURE\LIBRARY\DISCRETE.OLB; PCB DECAL: SM/R_1206
RN10-RN14 = RESAR_IS_4/SM: Source_Path: C:\ORCAD\ORCAD_10.5\TOOLS\CAPTURE\LIBRARY\DISCRETE.OLB; PCB DECAL: SMD_RX4
S2 = SW_DIP-8: Source_Path: C:\CADENCE\PSD_15.1\TOOLS\CAPTURE\LIBRARY\OLDLIBS\DEVICE.OLB; PCB DECAL: SMD_DIPSW_100
S3 = CON_EISAE_0: Source_Path: C:\CADENCE\PSD_15.1\TOOLS\ATLAS_ITA\ATLAS_ITA.DSN; PCB DECAL: PC104_REV13
STB1 = LM3940-3_3V: Source_Path: C:\PROJECTS\VHDL_PROJEKTI\DIS32\BIS32_16\BIS32_16.OLB; PCB DECAL: TO263AA_GND_PLANE_REV1
U4 U5 = MTHOLE_IZVLAKAC: Rupa za Rittal-ov izvlakac; PCB DECAL: MTH_IZVLAKAC_PADS
U11 = XCR3256XL-TQ208: Source_Path: C:\PROJECTS\XILINX_ORCAD_LIB\XILINX.OLB; PCB DECAL: QUAD.50M/208/WG30.60; Value: XCR3256XL-TQ208
U12 = CLK_GEN33: Source_Path: C:\PROJECTS\VHDL_PROJEKTI\DIS32\BIS32_16\BIS32_16.OLB; PCB DECAL: CLK_GEN33_REV1; Value: CLK_GEN33
U13 = LED8X1: Source_Path: C:\CADENCE\PSD_15.1\TOOLS\ATLAS_ITA\LIBRARY1.OLB; Geometry.Height: 5.08mm; Order No: 31 G 7692 Buerklin; PCB DECAL: LED_8_REV3_PADS; Description: LED8x1; Footprint: LED_8_REV2
UR1-UR4 = NAPAJANE_RUPA: Source_Path: E:\MILOS\PROJECTS\OBRTOMER\BPC02REV1\LIBRARY1.OLB; PCB DECAL: NAPAJANJE_RUPA_REV1
UR5-UR12 = FIDUCIAL_PADS: Source_Path: C:\BEKAP STAROG RACUNARA\FOHUB1\FO-HUB1VER.1.01\FOHUB1\SEME\HFBR0050Z.OLB; Geometry.Height: 10.00mil; PCB DECAL: FIDUCIAL_R_TOP

## Nets that join several sheets
DATA_MAX_BUS12: POWER_SUPPLY (6 pins), WDT_TASTERI_M_S (9 pins), MAX_BUS (53 pins), ISA_XILINX (9 pins)
GND: POWER_SUPPLY (9 pins), WDT_TASTERI_M_S (10 pins), MAX_BUS (15 pins), ATLAS_XP2V5.Sheet 5 (6 pins), ISA_XILINX (91 pins)
VCC_3V3: WDT_TASTERI_M_S (R15.2 R16.1), ATLAS_XP2V5.Sheet 5 (5 pins), ISA_XILINX (72 pins)
VCC_+12V: POWER_SUPPLY (REG1.1 S1.1), ISA_XILINX (U13.8)
VCC_-12V: POWER_SUPPLY (D2.1 REG1.2 U3.4), ISA_XILINX (R24.2)
/FLTB1: POWER_SUPPLY (R27.2 U14.4), ISA_XILINX (U11.58)
/NVRAM_RST: ATLAS_XP2V5.Sheet 5 (U16.1), ISA_XILINX (U11.140)
BALE: MAX_BUS (J16.B25 J16.C25 RN2.7), ISA_XILINX (U11.168)
BIQ_1: MAX_BUS (J16.B29 J16.C29 RN1.7), ISA_XILINX (U11.25)
BIQ_2: MAX_BUS (J16.B30 J16.C30 RN1.6), ISA_XILINX (U11.112)
BRD: MAX_BUS (J16.B27 J16.C27 RN2.5), ISA_XILINX (U11.169)
BRDY: MAX_BUS (J16.B24 J16.C24 RN2.8), ISA_XILINX (U11.110)
BWR: MAX_BUS (J16.B26 J16.C26 RN2.6), ISA_XILINX (U11.170)
CW6: WDT_TASTERI_M_S (JP4.1 RN9.5), ISA_XILINX (U11.147)
CW7_W/C: WDT_TASTERI_M_S (R12.1 U8.1), ISA_XILINX (U11.142)
IQ_I_SYN: MAX_BUS (US3.13), ISA_XILINX (U11.66)
IQ_O_ATP: MAX_BUS (7 pins), ISA_XILINX (U11.26)
IQ_O_SYN: MAX_BUS (7 pins), ISA_XILINX (U11.67)
IRQ9: MAX_BUS (JP1.1 JP2.1), ISA_XILINX (S3.B4)
IRQ10: MAX_BUS (JP1.3 JP2.3), ISA_XILINX (S3.D3)
IRQ11: MAX_BUS (JP1.5 JP2.5), ISA_XILINX (S3.D4)
IRQ12: MAX_BUS (JP1.7 JP2.7), ISA_XILINX (S3.D5)
IRQ14: MAX_BUS (JP1.11 JP2.11), ISA_XILINX (S3.D7)
IRQ15: MAX_BUS (JP1.9 JP2.9), ISA_XILINX (S3.D6)
MASTER_ENABLE: WDT_TASTERI_M_S (U10.2), ISA_XILINX (U11.113)
MRST: MAX_BUS (J16.B28 J16.C28 RN1.8), ISA_XILINX (U11.141)
MS_IN_1: WDT_TASTERI_M_S (J2.3 R15.1), ISA_XILINX (U11.88)
NVRAM_ADDRESS0: ATLAS_XP2V5.Sheet 5 (U15.14), ISA_XILINX (U11.129)
NVRAM_ADDRESS1: ATLAS_XP2V5.Sheet 5 (U15.13), ISA_XILINX (U11.128)
NVRAM_ADDRESS2: ATLAS_XP2V5.Sheet 5 (U15.12), ISA_XILINX (U11.126)
NVRAM_ADDRESS3: ATLAS_XP2V5.Sheet 5 (U15.11), ISA_XILINX (U11.124)
NVRAM_ADDRESS4: ATLAS_XP2V5.Sheet 5 (U15.10), ISA_XILINX (U11.123)
NVRAM_ADDRESS5: ATLAS_XP2V5.Sheet 5 (U15.9), ISA_XILINX (U11.122)
NVRAM_ADDRESS6: ATLAS_XP2V5.Sheet 5 (U15.8), ISA_XILINX (U11.121)
NVRAM_ADDRESS7: ATLAS_XP2V5.Sheet 5 (U15.7), ISA_XILINX (U11.120)
NVRAM_ADDRESS8: ATLAS_XP2V5.Sheet 5 (U15.29), ISA_XILINX (U11.119)
NVRAM_ADDRESS9: ATLAS_XP2V5.Sheet 5 (U15.28), ISA_XILINX (U11.102)
NVRAM_ADDRESS10: ATLAS_XP2V5.Sheet 5 (U15.25), ISA_XILINX (U11.101)
NVRAM_ADDRESS11: ATLAS_XP2V5.Sheet 5 (U15.27), ISA_XILINX (U11.100)
NVRAM_ADDRESS12: ATLAS_XP2V5.Sheet 5 (U15.6), ISA_XILINX (U11.99)
NVRAM_ADDRESS13: ATLAS_XP2V5.Sheet 5 (U15.30), ISA_XILINX (U11.98)
NVRAM_ADDRESS14: ATLAS_XP2V5.Sheet 5 (U15.5), ISA_XILINX (U11.97)
NVRAM_ADDRESS15: ATLAS_XP2V5.Sheet 5 (U15.33), ISA_XILINX (U11.96)
NVRAM_ADDRESS16: ATLAS_XP2V5.Sheet 5 (U15.4), ISA_XILINX (U11.95)
NVRAM_ADDRESS17: ATLAS_XP2V5.Sheet 5 (U15.32), ISA_XILINX (U11.93)
NVRAM_ADDRESS18: ATLAS_XP2V5.Sheet 5 (U15.3), ISA_XILINX (U11.92)
NVRAM_ADDRESS19: ATLAS_XP2V5.Sheet 5 (U15.35), ISA_XILINX (U11.91)
NVRAM_ADDRESS20: ATLAS_XP2V5.Sheet 5 (U15.2), ISA_XILINX (U11.90)
NVRAM_CE: ATLAS_XP2V5.Sheet 5 (U15.24), ISA_XILINX (U11.133)
NVRAM_DATA0: ATLAS_XP2V5.Sheet 5 (U15.15), ISA_XILINX (U11.188)
NVRAM_DATA1: ATLAS_XP2V5.Sheet 5 (U15.16), ISA_XILINX (U11.190)
NVRAM_DATA2: ATLAS_XP2V5.Sheet 5 (U15.17), ISA_XILINX (U11.192)
NVRAM_DATA3: ATLAS_XP2V5.Sheet 5 (U15.19), ISA_XILINX (U11.193)
NVRAM_DATA4: ATLAS_XP2V5.Sheet 5 (U15.20), ISA_XILINX (U11.194)
NVRAM_DATA5: ATLAS_XP2V5.Sheet 5 (U15.21), ISA_XILINX (U11.195)
NVRAM_DATA6: ATLAS_XP2V5.Sheet 5 (U15.22), ISA_XILINX (U11.196)
NVRAM_DATA7: ATLAS_XP2V5.Sheet 5 (U15.23), ISA_XILINX (U11.197)
NVRAM_OE: ATLAS_XP2V5.Sheet 5 (U15.26), ISA_XILINX (U11.136)
NVRAM_RST: ATLAS_XP2V5.Sheet 5 (U16.3), ISA_XILINX (U11.178)
NVRAM_WE: ATLAS_XP2V5.Sheet 5 (U15.31), ISA_XILINX (U11.137)
PPM_NOVI: MAX_BUS (R2.2 U2.4 US3.1), ISA_XILINX (U11.57)
PWR_GOOD_TPS: POWER_SUPPLY (R28.2 U14.14), ISA_XILINX (U11.149)
RESERVE1: WDT_TASTERI_M_S (J5.2 J6.2), ISA_XILINX (U11.114)
RESERVE2: WDT_TASTERI_M_S (J7.2 J8.2), ISA_XILINX (U11.115)
RESET_CPU: WDT_TASTERI_M_S (JP5.1 RN9.8 U9.1), ISA_XILINX (U11.111)
WDT_OUT_STARI: WDT_TASTERI_M_S (U1.5), ISA_XILINX (U11.56)
WDT_SIG_STARI: WDT_TASTERI_M_S (U1.4), ISA_XILINX (U11.68)
WDT_TRG: WDT_TASTERI_M_S (U1.1), ISA_XILINX (U11.55)
XP_PRESENT_IN: WDT_TASTERI_M_S (J2.6), ISA_XILINX (RN10.5 U11.89)
XP_PRESENT_OUT: WDT_TASTERI_M_S (J2.2), ISA_XILINX (S2.8)